# EAGLE schematic duckypad2020_v4 (EAGLE 9.6.2)
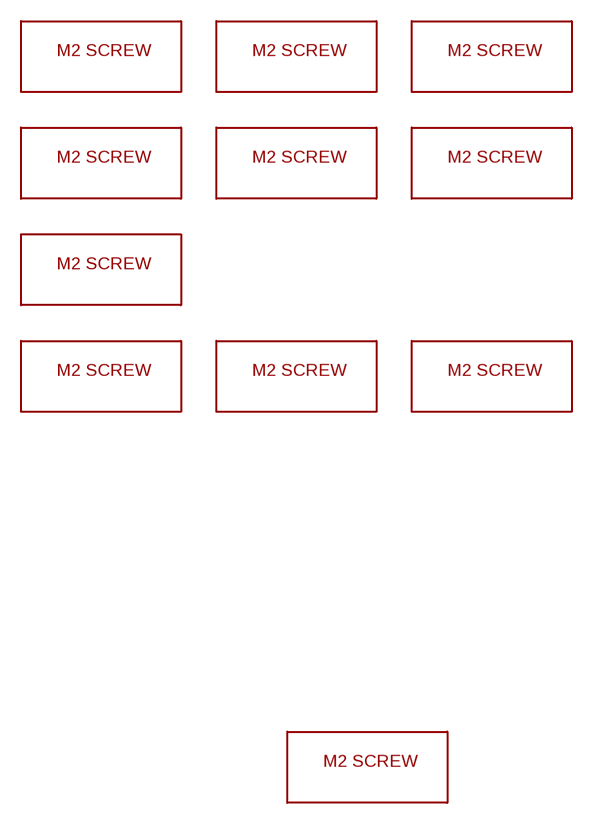
[diagram p0: schematic, sheet 1]

## Parts
U$1  M2_SCREW_DEV  [M2_SCREW_FOOT]
U$7  M2_SCREW_DEV  [M2_SCREW_FOOT]
U$8  M2_SCREW_DEV  [M2_SCREW_FOOT]
U$9  M2_SCREW_DEV  [M2_SCREW_FOOT]
U$10  M2_SCREW_DEV  [M2_SCREW_FOOT]
U$11  M2_SCREW_DEV  [M2_SCREW_FOOT]
U$12  M2_SCREW_DEV  [M2_SCREW_FOOT]
U$13  M2_SCREW_DEV  [M2_SCREW_FOOT]
U$15  M2_SCREW_DEV  [M2_SCREW_FOOT]
U$16  M2_SCREW_DEV  [M2_SCREW_FOOT]
U$23  M2_SCREW_DEV  [M2_SCREW_FOOT]

## Library data of the parts
U$1 U$7-U$13 U$15 U$16 U$23 = 3pos_slide_switch_centered:M2_SCREW_DEV